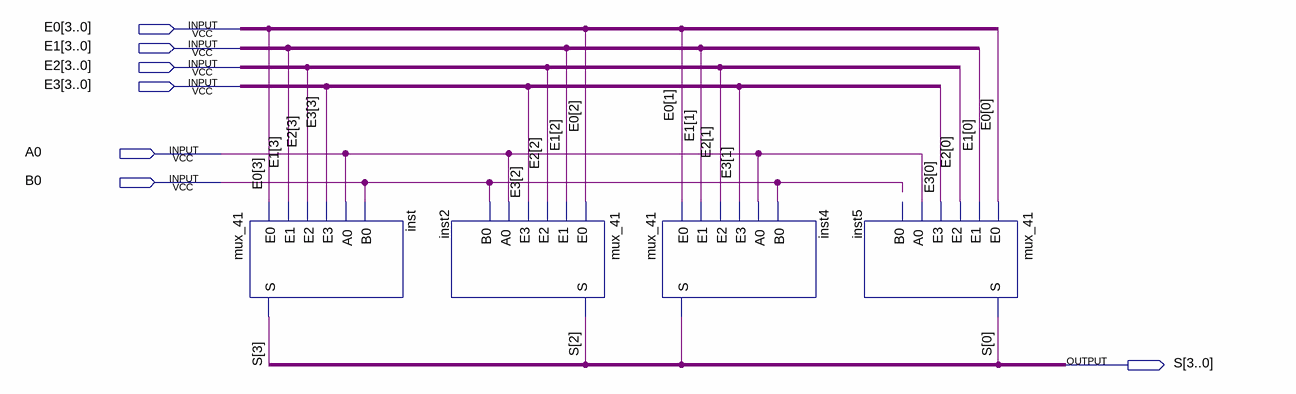
[diagram p0: schematic sheet]
// Quartus schematic mux_41_4b.bdf as structural Verilog: 4 symbols, 7 pins
module mux_41_4b (
  input  [3:0] E0,
  input  [3:0] E1,
  input  [3:0] E2,
  input  [3:0] E3,
  input  A0,
  input  B0,
  output [3:0] S
);

  wire inst4_s;

  mux_41 inst (.E0(E0[3]), .E1(E1[3]), .E2(E2[3]), .E3(E3[3]), .A0(A0), .B0(B0), .S(S[3]));
  mux_41 inst2 (.E0(E0[2]), .E1(E1[2]), .E2(E2[2]), .E3(E3[2]), .A0(A0), .B0(B0), .S(S[2]));
  mux_41 inst4 (.E0(E0[1]), .E1(E1[1]), .E2(E2[1]), .E3(E3[1]), .A0(A0), .B0(B0), .S(inst4_s));
  mux_41 inst5 (.E0(E0[0]), .E1(E1[0]), .E2(E2[0]), .E3(E3[0]), .A0(A0), .S(S[0]));  // open: B0
endmodule
